# Altium project norbi_lm.PrjPcb (part 2 of 2)

## Sheet norbi_lm_pl_dcr_power_ch.SchDoc: Имя
size 209 x 297 mm; ApprovedBy: Утвердил; CheckedBy: Проверил; Author: Разработал; Organization: НГУ; DocumentNumber: Децимальный номер Э3; SheetNumber: Лист; SheetTotal: Листов; PageSetup: Record=PageOptions|CenterHorizontal=True|CenterVertical=True|PrintScale=1.00|XCorrection=1.00|YCorrection=1.00|PrintKind=1|BorderSize=5000000|LeftOffset=0|BottomOffset=0|Orientation=2|PaperLength=1000|PaperWidth=1000|Scale=100|PaperSource=15|PrintQuality=1200|MediaType=1|DitherType=10|PaperKind=A3|PrintScaleMode=1; Weight: -; ScaleFactor: -; NormInspection: Норм.Контр.
Used 2 times, as channels pl_dcr/mcu_pwr, pl_dcr/measure_pwr. Parts and nets are listed once, with the designators drawn on the sheet.
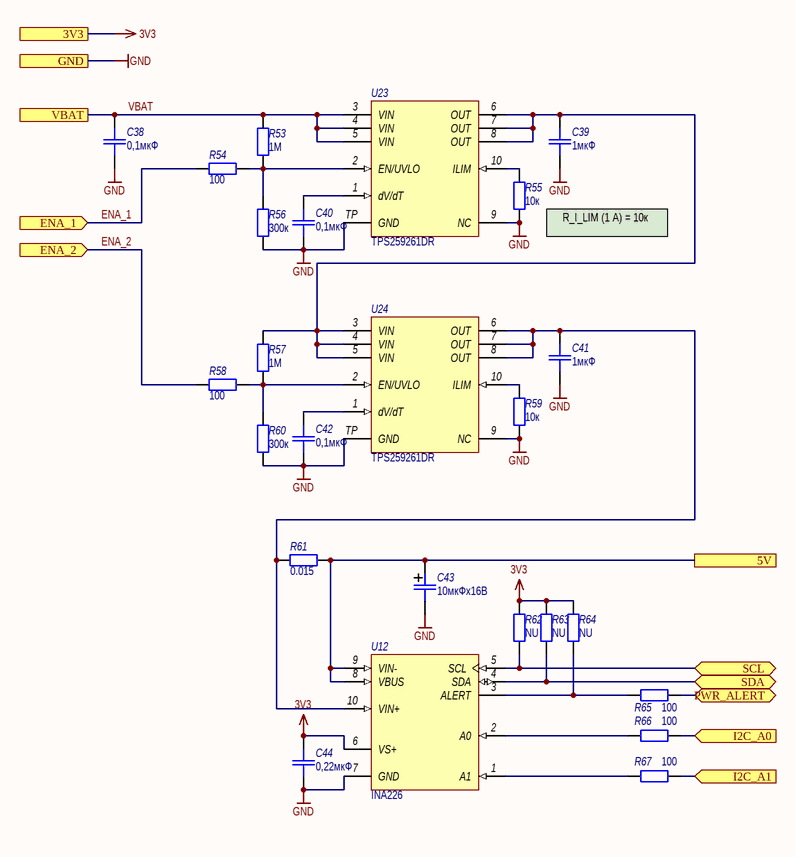
[diagram p5: norbi_lm_pl_dcr_power_ch.SchDoc]

### Parts
C38  0,1мкФ  [CR-0603]
C39  1мкФ  [CR-0603]
C40  0,1мкФ  [CR-0603]
C41  1мкФ  [CR-0603]
C42  0,1мкФ  [CR-0603]
C43  10мкФх16В  [C_SMD_SIZE_B]
C44  0,22мкФ  [CR-0603]
R53  1М  [CR-0603]
R54  100  [CR-0603]
R55  10к  [CR-0603]
R56  300к  [CR-0603]
R57  1М  [CR-0603]
R58  100  [CR-0603]
R59  10к  [CR-0603]
R60  300к  [CR-0603]
R61  0.015  [CR-1206]
R62  NU  [CR-0603]
R63  NU  [CR-0603]
R64  NU  [CR-0603]
R65  100  [CR-0603]
R66  100  [CR-0603]
R67  100  [CR-0603]
U12  INA261  [VSSOP-8]  (value not drawn)
U23  Наименование: TPS259261DR  [VSON-10]  (hidden comment: TPS259261ВК)
U24  Наименование: TPS259261DR  [VSON-10]  (hidden comment: TPS259261ВК)

### Ports
3V3, 5V, ENA_1 (in), ENA_2 (in), GND, I2C_A0 (in), I2C_A1 (in), PWR_ALERT (bidir), SCL (bidir), SDA (bidir), VBAT

### Nets
3V3: C44.2 R62.2 R63.2 R64.2 U12.6(VS+) ; port 3V3
GND: C38.1 C39.1 C40.1 C41.1 C42.1 C43.2 C44.1 R55.1 R56.1 R59.1 R60.1 U12.7(GND) U23.9(NC) U23.TP(GND) U24.9(NC) U24.TP(GND) ; port GND
5V: C43.1 R61.1 U12.8(VBUS) U12.9(VIN-) ; port 5V
ENA_1: R54.2 ; port ENA_1
ENA_2: R58.2 ; port ENA_2
I2C_A0: R66.1 ; port I2C_A0
I2C_A1: R67.1 ; port I2C_A1
PWR_ALERT: R65.1 ; port PWR_ALERT
SCL: R62.1 U12.5(SCL) ; port SCL
SDA: R63.1 U12.4(SDA) ; port SDA
VBAT: C38.2 R53.2 U23.3(VIN) U23.4(VIN) U23.5(VIN) ; port VBAT
NetC39_2: C39.2 R57.2 U23.6(OUT) U23.7(OUT) U23.8(OUT) U24.3(VIN) U24.4(VIN) U24.5(VIN)
NetC40_2: C40.2 U23.1(dV/dT)
NetC41_2: C41.2 R61.2 U12.10(VIN+) U24.6(OUT) U24.7(OUT) U24.8(OUT)
NetC42_2: C42.2 U24.1(dV/dT)
NetR53_1: R53.1 R54.1 R56.2 U23.2(EN/UVLO)
NetR55_2: R55.2 U23.10(ILIM)
NetR57_1: R57.1 R58.1 R60.2 U24.2(EN/UVLO)
NetR59_2: R59.2 U24.10(ILIM)
NetR64_1: R64.1 R65.2 U12.3(ALERT)
NetR66_2: R66.2 U12.2(A0)
NetR67_2: R67.2 U12.1(A1)

### Channels
pl_dcr/mcu_pwr: designators end in _1; ports 3V3=3V3 5V=5V_MCU_PLDCR ENA_1=PWR_ENA1_1_PLDCR ENA_2=PWR_ENA1_2_PLDCR GND=GND I2C_A0=3V3 I2C_A1=3V3 PWR_ALERT=PWR_ALERT SCL=PWR_SCL SDA=PWR_SDA VBAT=VBAT
pl_dcr/measure_pwr: designators end in _2; ports 3V3=3V3 5V=5V_MEAS_PLDCR ENA_1=PWR_ENA2_1_PLDCR ENA_2=PWR_ENA2_2_PLDCR GND=GND I2C_A0=PWR_SDA I2C_A1=3V3 PWR_ALERT=PWR_ALERT SCL=PWR_SCL SDA=PWR_SDA VBAT=VBAT

### Notes on the sheet
- (near R55) R_I_LIM (1 А) = 10к
- Подп. и дата
- Инв. № дубл.
- Взам. инв. №
- Инв. № подл.
- Изм.
- Лист
- № докум.
- Подп.
- Дата
- Форма 2а ГОСТ 2.104-2006
- Копировал
- Формат А4

### Library data of the parts
C38-C42 C44 = C_smd: as C1 on sheet norbi_lm_main; Наименование: SMD-0603
  C38 C40 C42: Value: 0,1мкФ
  C39 C41: Value: 1мкФ
  C44: Value: 0,22мкФ
C43 = C_pol_smd: as C27 on sheet norbi_lm_single_power_ch; Value: 10мкФх16В
R53 R56 R57 R60 R62-R64 = R_smd: as R31 on sheet norbi_lm_single_power_ch
  R53 R57: Value: 1М
  R56 R60: Value: 300к
  R62-R64: Value: NU
R54 R55 R58 R59 R65-R67 = R_smd: as R20 on sheet norbi_lm_pl_interface
  R54 R58 R65-R67: Value: 100
  R55 R59: Value: 10к
R61 = R_smd: Резистор для поверхностного монтажа; Назначение: Чип-резистор токоизмерительный; Наименование: PE1206DRM470R015L; Потребление, Вт: 0,001; Value: 0.015
U12 = INA226: High- or Low-Side Measurement, Bidirectional Current and Power Monitor With I2C Interface; Назначение: High-Side or Low-Side Measurement,; Потребление, Вт: 0,001; ComponentLink1Description: Data sheet; ComponentLink1URL: http://www.ti.com/lit/ds/symlink/ina226.pdf; Наименование: INA226
U23 U24 = TPS259261: Simple 5-V/12-V eFuse Protection Switches; Потребление, Вт: 0,001; Назначение: Simple 5-V/12-V eFuse Protection Switches; ComponentLink1Description: Datasheet; ComponentLink1URL: http://www.ti.com/lit/ds/symlink/tps25925.pdf

## Sheet norbi_lm_interface.SchDoc: Имя
size 209 x 297 mm; ApprovedBy: Утвердил; CheckedBy: Проверил; Author: Разработал; Organization: НГУ; DocumentNumber: Децимальный номер Э3; SheetNumber: Лист; SheetTotal: Листов; PageSetup: Record=PageOptions|CenterHorizontal=True|CenterVertical=True|PrintScale=1.00|XCorrection=1.00|YCorrection=1.00|PrintKind=1|BorderSize=5000000|LeftOffset=0|BottomOffset=0|Orientation=2|PaperLength=1000|PaperWidth=1000|Scale=100|PaperSource=15|PrintQuality=1200|MediaType=1|DitherType=10|PaperKind=A3|PrintScaleMode=1; Weight: -; ScaleFactor: -; NormInspection: Норм.Контр.
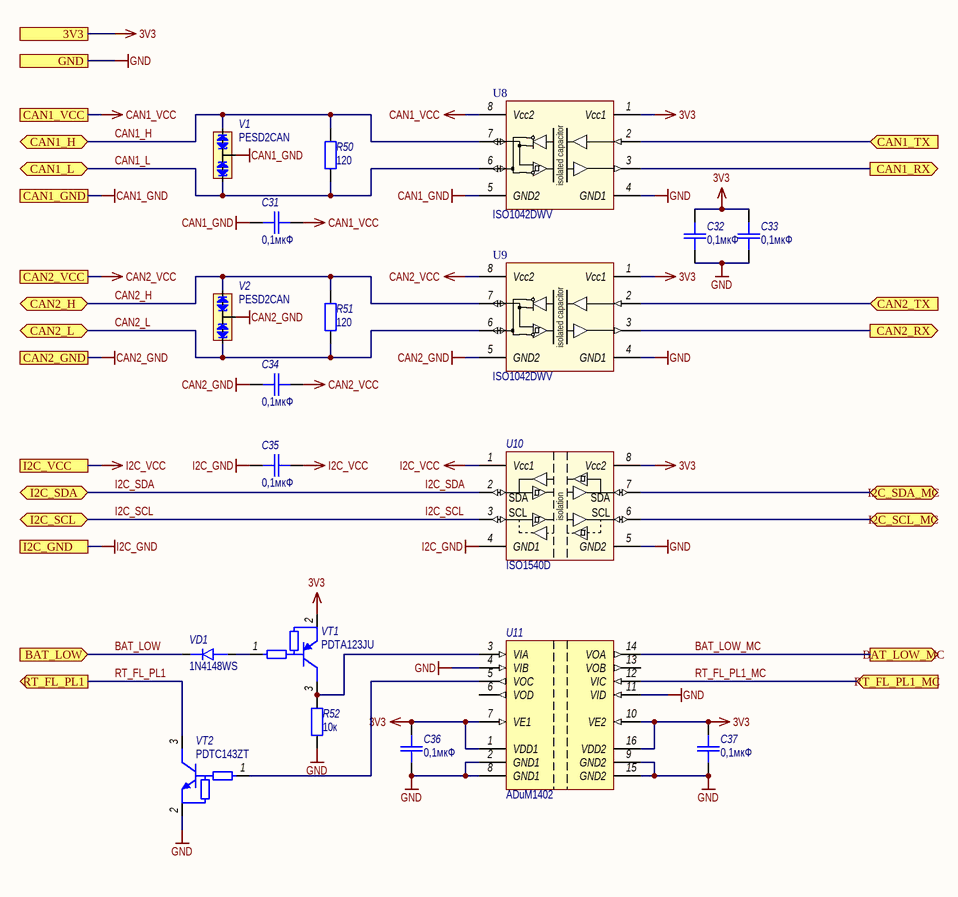
[diagram p6: norbi_lm_interface.SchDoc]

### Parts
C31  0,1мкФ  [CR-0603]
C32  0,1мкФ  [CR-0603]
C33  0,1мкФ  [CR-0603]
C34  0,1мкФ  [CR-0603]
C35  0,1мкФ  [CR-0603]
C36  0,1мкФ  [CR-0603]
C37  0,1мкФ  [CR-0603]
R50  120  [CR-0603]
R51  120  [CR-0603]
R52  10к  [CR-0603]
U8  Наименование: ISO1042DWV  [SOIC-8-WIDE]  (hidden comment: ISO1042)
U9  Наименование: ISO1042DWV  [SOIC-8-WIDE]  (hidden comment: ISO1042)
U10  Наименование: ISO1540D  [SOIC-8]  (hidden comment: ISO1540)
U11  ADuM1402  [SOIC-16-WIDE]
V1  PESD2CAN  [SOT-23]
V2  PESD2CAN  [SOT-23]
VD1  1N4148WS  [SOD-323]
VT1  PDTA123JU  [SOT-323 (SC-70)]
VT2  PDTC143ZT  [SOT-23]

### Ports
3V3, BAT_LOW (in), BAT_LOW_MC (out), CAN1_GND, CAN1_H (bidir), CAN1_L (bidir), CAN1_RX (out), CAN1_TX (in), CAN1_VCC, CAN2_GND, CAN2_H (bidir), CAN2_L (bidir), CAN2_RX (out), CAN2_TX (in), CAN2_VCC, GND, I2C_GND, I2C_SCL (bidir), I2C_SCL_MC (bidir), I2C_SDA (bidir), I2C_SDA_MC (bidir), I2C_VCC, RT_FL_PL1 (out), RT_FL_PL1_MC (in)

### Nets
3V3: C32.2 C33.2 C36.2 C37.2 U8.1(Vcc1) U9.1(Vcc1) U10.8(Vcc2) U11.1(VDD1) U11.7(VE1) U11.10(VE2) U11.16(VDD2) VT1.2(E) ; port 3V3
CAN1_GND: C31.1 U8.5(GND2) V1.3(CC) ; port CAN1_GND
CAN1_VCC: C31.2 U8.8(Vcc2) ; port CAN1_VCC
CAN2_GND: C34.1 U9.5(GND2) V2.3(CC) ; port CAN2_GND
CAN2_VCC: C34.2 U9.8(Vcc2) ; port CAN2_VCC
GND: C32.1 C33.1 C36.1 C37.1 R52.2 U8.4(GND1) U9.4(GND1) U10.5(GND2) U11.2(GND1) U11.4(VIB) U11.8(GND1) U11.9(GND2) U11.11(VID) U11.15(GND2) VT2.2(E) ; port GND
I2C_GND: C35.1 U10.4(GND1) ; port I2C_GND
I2C_VCC: C35.2 U10.1(Vcc1) ; port I2C_VCC
BAT_LOW: VD1.1(Cathode) ; port BAT_LOW
BAT_LOW_MC: U11.14(VOA) ; port BAT_LOW_MC
CAN1_H: R50.2 U8.7(CANH) V1.1(C1) ; port CAN1_H
CAN1_L: R50.1 U8.6(CANL) V1.2(C2) ; port CAN1_L
CAN1_RX: U8.3(RXD) ; port CAN1_RX
CAN1_TX: U8.2(TXD) ; port CAN1_TX
CAN2_H: R51.2 U9.7(CANH) V2.1(C1) ; port CAN2_H
CAN2_L: R51.1 U9.6(CANL) V2.2(C2) ; port CAN2_L
CAN2_RX: U9.3(RXD) ; port CAN2_RX
CAN2_TX: U9.2(TXD) ; port CAN2_TX
I2C_SCL: U10.3(SCL) ; port I2C_SCL
I2C_SCL_MC: U10.6(SCL) ; port I2C_SCL_MC
I2C_SDA: U10.2(SDA) ; port I2C_SDA
I2C_SDA_MC: U10.7(SDA) ; port I2C_SDA_MC
RT_FL_PL1: VT2.3(C) ; port RT_FL_PL1
RT_FL_PL1_MC: U11.12(VIC) ; port RT_FL_PL1_MC
NetR52_1: R52.1 U11.3(VIA) VT1.3(C)
NetU11_5: U11.5(VOC) VT2.1(B)
NetVD1_2: VD1.2(Anode) VT1.1(B)

Not connected (* = marked no-connect by the designer): U11 6(VOD) 13(VOB)

### Notes on the sheet
- Подп. и дата
- Инв. № дубл.
- Взам. инв. №
- Инв. № подл.
- Изм.
- Лист
- № докум.
- Подп.
- Дата
- Форма 2а ГОСТ 2.104-2006
- Копировал
- Формат А4
- (in symbol ISO154x) isolation
- (in symbol ISO1042) isolated capacitor

### Library data of the parts
C31-C37 = C_smd: Конденсатор для поверхностного монтажа; Назначение: Чип-конденсатор; Потребление, Вт: 0; Наименование: SMD-0603; Value: 0,1мкФ
R50 R51 = R_smd: Резистор для поверхностного монтажа; Наименование: SMD-0603 1%; Назначение: Чип-резистор; Потребление, Вт: 0,001; Value: 120
R52 = R_smd: Резистор для поверхностного монтажа; Наименование: SMD-0603 20%; Назначение: Чип-резистор; Потребление, Вт: 0,001; Value: 10к
U8 U9 = ISO1042: Isolated CAN Transceiver; Назначение: Изолированный CAN приемник; Потребление, Вт: 0,001
U10 = ISO154x: Low-Power Bidirectional I2C Isolators; Потребление, Вт: 0,001; Назначение: Low-Power Bidirectional I2C Isolators
U11 = ADuM1402: Quad Channel Digital Isolator, 2.5 KV rms Insulation Rating; Назначение: 4-канальный цифровой изолятор; Потребление, Вт: 0,025; Наименование: ADuM1402
V1 V2 = PESD2CAN: CAN bus ESD protection diode; Назначение: Защитная диодная сборка CAN-шины от ЭСР; Потребление, Вт: 0,001; Наименование: PESD2CAN
VD1 = BAT60A: Diod 150 mA 100V; Назначение: Диод 150мА 100В; Потребление, Вт: 0,001; Наименование: 1N4148WS
VT1 = PDTA123JU: Digital Transistor (resistor-equipped transistors), R1=R2=2k, PNP Transistor, 3-Pin SC-70; Назначение: Resistor-equipped transistors, R1=R2=2k, PNP Transistor, 3-Pin SC-70; Потребление, Вт: 0,001; ComponentLink1Description: Datasheet; ComponentLink1URL: https://assets.nexperia.com/documents/data-sheet/PDTC114E_SER.pdf; Наименование: PDTA123JU
VT2 = PDTC143ZT: Digital Transistor (BRT), R1=4.7 kOhm, R2=47 kOhm, NPN Transistor, 3-Pin; Потребление, Вт: 0,001; Назначение: Digital Transistor (BRT), R1=4.7 kOhm, R2=47 kOhm, NPN Transistor, 3-Pin; ComponentLink1Description: Datasheet; ComponentLink1URL: https://assets.nexperia.com/documents/data-sheet/PDTC114E_SER.pdf; Наименование: PDTC143ZT

## Sheet norbi_lm_trm.SchDoc: Имя
size 209 x 297 mm; ApprovedBy: Утвердил; CheckedBy: Проверил; Author: Разработал; Organization: НГУ; DocumentNumber: Децимальный номер Э3; SheetNumber: Лист; SheetTotal: Листов; PageSetup: Record=PageOptions|CenterHorizontal=True|CenterVertical=True|PrintScale=1.00|XCorrection=1.00|YCorrection=1.00|PrintKind=1|BorderSize=5000000|LeftOffset=0|BottomOffset=0|Orientation=2|PaperLength=1000|PaperWidth=1000|Scale=100|PaperSource=15|PrintQuality=1200|MediaType=1|DitherType=10|PaperKind=A3|PrintScaleMode=1; Weight: -; ScaleFactor: -; NormInspection: Норм.Контр.
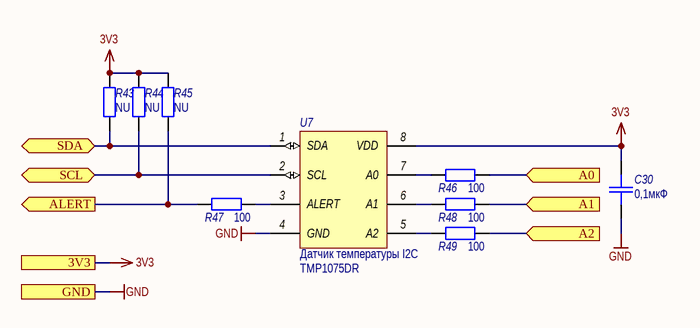
[diagram p7: norbi_lm_trm.SchDoc]

### Parts
C30  0,1мкФ  [CR-0603]
R43  NU  [CR-0603]
R44  NU  [CR-0603]
R45  NU  [CR-0603]
R46  100  [CR-0603]
R47  100  [CR-0603]
R48  100  [CR-0603]
R49  100  [CR-0603]
U7  Назначение: Датчик температуры I2C  Наименование: TMP1075DR  [SOIC-8]  (hidden comment: TMP1075)

### Ports
3V3, A0 (in), A1 (in), A2 (in), ALERT (out), GND, SCL (bidir), SDA (bidir)

### Nets
3V3: C30.2 R43.2 R44.2 R45.2 R46.1 R48.1 R49.1 U7.8(VDD) ; port 3V3, port A0, port A1, port A2
GND: C30.1 U7.4(GND) ; port GND
TRM_ALERT: R45.1 R47.2 ; port ALERT
TRM_SCL: R44.1 U7.2(SCL) ; port SCL
TRM_SDA: R43.1 U7.1(SDA) ; port SDA
NetR46_2: R46.2 U7.7(A0)
NetR47_1: R47.1 U7.3(ALERT)
NetR48_2: R48.2 U7.6(A1)
NetR49_2: R49.2 U7.5(A2)

### Notes on the sheet
- Подп. и дата
- Инв. № дубл.
- Взам. инв. №
- Инв. № подл.
- Изм.
- Лист
- № докум.
- Подп.
- Дата
- Форма 2а ГОСТ 2.104-2006
- Копировал
- Формат А4

### Library data of the parts
C30 = C_smd: as C31-C37 on sheet norbi_lm_interface; Наименование: SMD-0603; Value: 0,1мкФ
R43-R45 = R_smd: Резистор для поверхностного монтажа; Назначение: Чип-резистор; Наименование: SMD-0603 20%; Потребление, Вт: 0,001; Value: NU
R46-R49 = R_smd: as R52 on sheet norbi_lm_interface; Value: 100
U7 = TMP1075: TMP1075 Temperature Sensor With I2C and SMBus Interface; Потребление, Вт: 0,001; ComponentLink1Description: Datasheet; ComponentLink1URL: http://www.ti.com/lit/ds/symlink/tmp1075.pdf

## Sheet norbi_lm_mem.SchDoc: Имя
size 209 x 297 mm; ApprovedBy: Утвердил; CheckedBy: Проверил; Author: Разработал; Organization: НГУ; DocumentNumber: Децимальный номер Э3; SheetNumber: Лист; SheetTotal: Листов; PageSetup: Record=PageOptions|CenterHorizontal=True|CenterVertical=True|PrintScale=1.00|XCorrection=1.00|YCorrection=1.00|PrintKind=1|BorderSize=5000000|LeftOffset=0|BottomOffset=0|Orientation=2|PaperLength=1000|PaperWidth=1000|Scale=100|PaperSource=15|PrintQuality=1200|MediaType=1|DitherType=10|PaperKind=A3|PrintScaleMode=1; Weight: -; ScaleFactor: -; NormInspection: Норм.Контр.
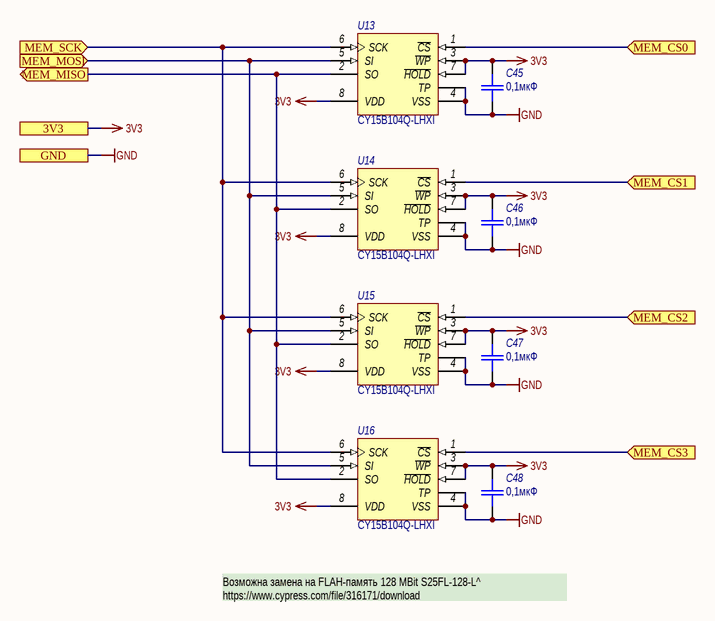
[diagram p8: norbi_lm_mem.SchDoc]

### Parts
C45  0,1мкФ  [CR-0603]
C46  0,1мкФ  [CR-0603]
C47  0,1мкФ  [CR-0603]
C48  0,1мкФ  [CR-0603]
U13  Наименование: CY15B104Q-LHXI  [TDFN-8]  (hidden comment: FM25V20)
U14  Наименование: CY15B104Q-LHXI  [TDFN-8]  (hidden comment: FM25V20)
U15  Наименование: CY15B104Q-LHXI  [TDFN-8]  (hidden comment: FM25V20)
U16  Наименование: CY15B104Q-LHXI  [TDFN-8]  (hidden comment: FM25V20)

### Ports
3V3, GND, MEM_CS0 (in), MEM_CS1 (in), MEM_CS2 (in), MEM_CS3 (in), MEM_MISO (out), MEM_MOSI (in), MEM_SCK (in)

### Nets
3V3: C45.2 C46.2 C47.2 C48.2 U13.3(~{WP}) U13.7(~{HOLD}) U13.8(VDD) U14.3(~{WP}) U14.7(~{HOLD}) U14.8(VDD) U15.3(~{WP}) U15.7(~{HOLD}) U15.8(VDD) U16.3(~{WP}) U16.7(~{HOLD}) U16.8(VDD) ; port 3V3
GND: C45.1 C46.1 C47.1 C48.1 U13.4(VSS) U13.TP U14.4(VSS) U14.TP U15.4(VSS) U15.TP U16.4(VSS) U16.TP ; port GND
MEM_CS0: U13.1(~{CS}) ; port MEM_CS0
MEM_CS1: U14.1(~{CS}) ; port MEM_CS1
MEM_CS2: U15.1(~{CS}) ; port MEM_CS2
MEM_CS3: U16.1(~{CS}) ; port MEM_CS3
MEM_MISO: U13.2(SO) U14.2(SO) U15.2(SO) U16.2(SO) ; port MEM_MISO
MEM_MOSI: U13.5(SI) U14.5(SI) U15.5(SI) U16.5(SI) ; port MEM_MOSI
MEM_SCK: U13.6(SCK) U14.6(SCK) U15.6(SCK) U16.6(SCK) ; port MEM_SCK

### Notes on the sheet
- Возможна замена на FLAH-память 128 MBit S25FL-128-L^
  https://www.cypress.com/file/316171/download
- Подп. и дата
- Инв. № дубл.
- Взам. инв. №
- Инв. № подл.
- Изм.
- Лист
- № докум.
- Подп.
- Дата
- Форма 2а ГОСТ 2.104-2006
- Копировал
- Формат А4

### Library data of the parts
C45-C48 = C_smd: as C31-C37 on sheet norbi_lm_interface; Наименование: SMD-0603; Value: 0,1мкФ
U13-U16 = FM25V: 2Mb Serial 3V FRAM Memory; Назначение: 4Mb Serial 3V FRAM Memory; Потребление, Вт: 0,009; ComponentLink1Description: Datasheet
  U13: ComponentLink1URL: https://www.cypress.com/file/209146/download
  U14-U16: ComponentLink1URL: https://www.cypress.com/file/136456/download

## Sheet norbi_lm_usb.SchDoc: Имя
size 209 x 297 mm; ApprovedBy: Утвердил; CheckedBy: Проверил; Author: Разработал; Organization: НГУ; DocumentNumber: Децимальный номер Э3; SheetNumber: Лист; SheetTotal: Листов; PageSetup: Record=PageOptions|CenterHorizontal=True|CenterVertical=True|PrintScale=1.00|XCorrection=1.00|YCorrection=1.00|PrintKind=1|BorderSize=5000000|LeftOffset=0|BottomOffset=0|Orientation=2|PaperLength=1000|PaperWidth=1000|Scale=100|PaperSource=15|PrintQuality=1200|MediaType=1|DitherType=10|PaperKind=A3|PrintScaleMode=1; Weight: -; ScaleFactor: -; NormInspection: Норм.Контр.
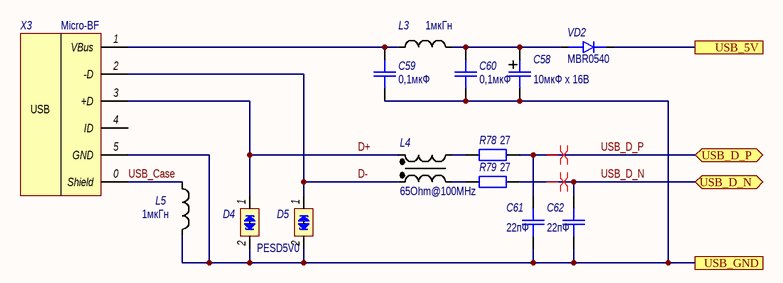
[diagram p9: norbi_lm_usb.SchDoc]

### Parts
C58  10мкФ х 16В  [C_SMD_SIZE_B]
C59  0,1мкФ  [CR-0603]
C60  0,1мкФ  [CR-0603]
C61  22пФ  [CR-0603]
C62  22пФ  [CR-0603]
D4  PESD5V0  [SOD-323]
D5  PESD5V0  [SOD-323]  (value not drawn)
L3  1мкГн  [CR-0805]
L4  65Ohm@100MHz  [ACM2012]
L5  1мкГн  [CR-0805]
R78  27  [CR-0603]
R79  27  [CR-0603]
VD2  MBR0540  [SOD-323]
X3  Наименование: Micro-BF  [USB Micro-BF]  (hidden comment: mico-BF)

### Ports
USB_5V, USB_D_N (bidir), USB_D_P (bidir), USB_GND

### Nets
GND: C58.2 C59.1 C60.1 C61.1 C62.1 D4.2(cathode_2) D5.2(cathode_2) L5.2 X3.5(GND) ; port USB_GND
D+: D4.1(cathode_1) L4.2 X3.3(+D)
D-: D5.1(cathode_1) L4.1 X3.2(-D)
USB_Case: L5.1 X3.0(Shield)
USB_D_N: C62.2 R79.1 ; port USB_D_N
USB_D_P: C61.2 R78.1 ; port USB_D_P
NetC58_1: C58.1 C60.2 L3.2 VD2.2(Anode)
NetC59_2: C59.2 L3.1 X3.1(VBus)
NetL4_3: L4.3 R78.2
NetL4_4: L4.4 R79.2
NetR1_1: VD2.1(Cathode) ; port USB_5V

Not connected (* = marked no-connect by the designer): X3 4(ID)

### Layout directives
differential pair: USB_D_N, USB_D_P

### Notes on the sheet
- Подп. и дата
- Инв. № дубл.
- Взам. инв. №
- Инв. № подл.
- Изм.
- Лист
- № докум.
- Подп.
- Дата
- Форма 2а ГОСТ 2.104-2006
- Копировал
- Формат А4
- (in symbol MicroUSB) USB

### Library data of the parts
C58 = C_pol_smd: Поляризованный конеднсатор для поверхностного монтажа; Назначение: Поляризованный чип-конденсатор; Наименование: Конденсатор танталовый SMD; Потребление, Вт: 0; Value: 10мкФ х 16В
C59-C62 = C_smd: as C31-C37 on sheet norbi_lm_interface; Наименование: SMD-0603
  C59 C60: Value: 0,1мкФ
  C61 C62: Value: 22пФ
D4 D5 = PESD5V0S: Low capacitance bidirectional ESD protection diodes; Назначение: ESD защитные диоды; Потребление, Вт: 0,000; Наименование: PESD5V0S1BA
L3 L5 = L_smd: Индуктивность для поверхностнгого монтажа; Назначение: Чип-индуктивность; Потребление, Вт: 0,010; Value: 1мкГн; Наименование: Индуктивность
L4 = ACM2012_USB_CM_FILTER: USB common mode filter; Назначение: Связанная индуктивность; Наименование: ACM2012-900-2P; Потребление, Вт: 0,001; Value: 65Ohm@100MHz
R78 R79 = R_smd: as R52 on sheet norbi_lm_interface; Value: 27
VD2 = BAT60A: Schottky diode; Назначение: Диод шотки; Потребление, Вт: 0,001; Наименование: MBR0540
X3 = MicroUSB: USB mico-BF; Назначение: Micro-USB разъем на плату

## Nets that join several sheets
3V3: norbi_lm_main (44 pins), norbi_lm_pl_iss (H1.14), pl_iss/pl_interface_1 (11 pins), pl_iss/pl_interface_2 (11 pins), pl_iss/pl_interface_3 (11 pins), pl_iss/pl_interface_4 (11 pins), pl_iss/pl_pwr_ch_1 (7 pins), pl_iss/pl_pwr_ch_2 (6 pins), pl_iss/pl_pwr_ch_3 (6 pins), pl_iss/pl_pwr_ch_4 (7 pins), norbi_lm_pl_dcr (6 pins), pl_dcr/mcu_pwr (7 pins), pl_dcr/measure_pwr (6 pins), norbi_lm_interface (12 pins), norbi_lm_trm (8 pins), norbi_lm_mem (16 pins), lm_pwr_ch (9 pins)
5V_PL1.1B: norbi_lm_pl_iss (H2.5 H2.7), pl_iss/pl_interface_2 (15 pins), pl_iss/pl_pwr_ch_2 (R30_2.1 U6_2.8 U6_2.9)
5V_PL1.1А: norbi_lm_pl_iss (H1.5 H1.7), pl_iss/pl_interface_1 (15 pins), pl_iss/pl_pwr_ch_1 (R30_1.1 U6_1.8 U6_1.9)
5V_PL1.2: norbi_lm_pl_iss (H2.27 H2.29), pl_iss/pl_interface_3 (15 pins), pl_iss/pl_pwr_ch_3 (R30_3.1 U6_3.8 U6_3.9)
5V_PL2: norbi_lm_pl_iss (6 pins), pl_iss/pl_interface_4 (15 pins), pl_iss/pl_pwr_ch_4 (R30_4.1 U6_4.8 U6_4.9)
CAN1_GND: norbi_lm_main (H3.5 H3.6), norbi_lm_interface (C31.1 U8.5 V1.3)
CAN1_VCC: norbi_lm_main (H3.7 H3.8), norbi_lm_interface (C31.2 U8.8)
CAN2_GND: norbi_lm_main (H3.13 H3.14), norbi_lm_interface (C34.1 U9.5 V2.3)
CAN2_VCC: norbi_lm_main (H3.15 H3.16), norbi_lm_interface (C34.2 U9.8)
GND: norbi_lm_main (40 pins), norbi_lm_pl_iss (24 pins), pl_iss/pl_interface_1 (27 pins), pl_iss/pl_interface_2 (27 pins), pl_iss/pl_interface_3 (27 pins), pl_iss/pl_interface_4 (27 pins), pl_iss/pl_pwr_ch_1 (22 pins), pl_iss/pl_pwr_ch_2 (22 pins), pl_iss/pl_pwr_ch_3 (22 pins), pl_iss/pl_pwr_ch_4 (22 pins), norbi_lm_pl_dcr (11 pins), pl_dcr/mcu_pwr (16 pins), pl_dcr/measure_pwr (16 pins), norbi_lm_interface (15 pins), norbi_lm_trm (C30.1 U7.4), norbi_lm_mem (12 pins), lm_pwr_ch (25 pins), norbi_lm_usb (9 pins)
I2C_GND: norbi_lm_main (H3.25 H3.26), norbi_lm_interface (C35.1 U10.4)
I2C_VCC: norbi_lm_main (H3.27 H3.28), norbi_lm_interface (C35.2 U10.1)
VBAT: norbi_lm_main (R1.2 R2.2 R3.2), pl_iss/pl_pwr_ch_1 (10 pins), pl_iss/pl_pwr_ch_2 (10 pins), pl_iss/pl_pwr_ch_3 (10 pins), pl_iss/pl_pwr_ch_4 (10 pins), pl_dcr/mcu_pwr (5 pins), pl_dcr/measure_pwr (5 pins), lm_pwr_ch (10 pins)
5V_MCU_PLDCR: norbi_lm_pl_dcr (X2.3), pl_dcr/mcu_pwr (C43_1.1 R61_1.1 U12_1.8 U12_1.9)
5V_MEAS_PLDCR: norbi_lm_pl_dcr (X2.4), pl_dcr/measure_pwr (C43_2.1 R61_2.1 U12_2.8 U12_2.9)
A_CPU_ERROR: norbi_lm_main (U1.2), pl_iss/pl_interface_1 (U20_1.11)
A_CPU_ERROR_PL: norbi_lm_pl_iss (H1.20), pl_iss/pl_interface_1 (R73_1.1)
A_INT: norbi_lm_main (U1.141), pl_iss/pl_interface_1 (U20_1.14)
A_INT_PL: norbi_lm_pl_iss (H1.17), pl_iss/pl_interface_1 (U20_1.3)
A_PWR_ERROR: norbi_lm_main (U1.142), pl_iss/pl_interface_1 (U20_1.13)
A_PWR_ERROR_PL: norbi_lm_pl_iss (H1.19), pl_iss/pl_interface_1 (U20_1.4)
A_RSTFPGA: norbi_lm_main (U1.56), pl_iss/pl_interface_1 (U19_1.3)
A_RSTFPGA_PL: norbi_lm_pl_iss (H1.11), pl_iss/pl_interface_1 (U19_1.14)
A_RSTLEON: norbi_lm_main (U1.57), pl_iss/pl_interface_1 (U19_1.4)
A_RSTLEON_PL: norbi_lm_pl_iss (H1.12), pl_iss/pl_interface_1 (U19_1.13)
A_WATCHDOG: norbi_lm_main (U1.1), pl_iss/pl_interface_1 (U20_1.12)
A_WATCHDOG_PL: norbi_lm_pl_iss (H1.18), pl_iss/pl_interface_1 (U20_1.5)
B_CPU_ERROR: norbi_lm_main (U1.58), pl_iss/pl_interface_2 (U20_2.11)
B_CPU_ERROR_PL: norbi_lm_pl_iss (H2.20), pl_iss/pl_interface_2 (R73_2.1)
B_INT: norbi_lm_main (U1.3), pl_iss/pl_interface_2 (U20_2.14)
B_INT_PL: norbi_lm_pl_iss (H2.17), pl_iss/pl_interface_2 (U20_2.3)
B_PWR_ERROR: norbi_lm_main (U1.4), pl_iss/pl_interface_2 (U20_2.13)
B_PWR_ERROR_PL: norbi_lm_pl_iss (H2.19), pl_iss/pl_interface_2 (U20_2.4)
B_RSTFPGA: norbi_lm_main (U1.89), pl_iss/pl_interface_2 (U19_2.3)
B_RSTFPGA_PL: norbi_lm_pl_iss (H2.11), pl_iss/pl_interface_2 (U19_2.14)
B_RSTLEON: norbi_lm_main (U1.90), pl_iss/pl_interface_2 (U19_2.4)
B_RSTLEON_PL: norbi_lm_pl_iss (H2.12), pl_iss/pl_interface_2 (U19_2.13)
B_WATCHDOG: norbi_lm_main (U1.5), pl_iss/pl_interface_2 (U20_2.12)
B_WATCHDOG_PL: norbi_lm_pl_iss (H2.18), pl_iss/pl_interface_2 (U20_2.5)
BAT_LOW: norbi_lm_main (H3.17 H3.18), norbi_lm_interface (VD1.1)
BAT_LOW_MC: norbi_lm_main (U1.27), norbi_lm_interface (U11.14)
C_TK_nRESET: norbi_lm_main (U1.93), pl_iss/pl_interface_3 (U19_3.3)
C_TK_nRESET_PL: norbi_lm_pl_iss (H2.31), pl_iss/pl_interface_3 (U19_3.14)
C_TK_SPI_SEL: norbi_lm_main (U1.124), pl_iss/pl_interface_3 (U19_3.4)
C_TK_SPI_SEL_PL: norbi_lm_pl_iss (H2.33), pl_iss/pl_interface_3 (U19_3.13)
C_TM_CPU_OK: norbi_lm_main (U1.63), pl_iss/pl_interface_3 (U20_3.12)
C_TM_CPU_OK_PL: norbi_lm_pl_iss (H2.37), pl_iss/pl_interface_3 (U20_3.5)
C_TM_ERR: norbi_lm_main (U1.64), pl_iss/pl_interface_3 (U20_3.11)
C_TM_ERR_PL: norbi_lm_pl_iss (H2.38), pl_iss/pl_interface_3 (R73_3.1)
C_TM_INT: norbi_lm_main (U1.60), pl_iss/pl_interface_3 (U20_3.13)
C_TM_INT_PL: norbi_lm_pl_iss (H2.36), pl_iss/pl_interface_3 (U20_3.4)
C_TM_PWR_ERR: norbi_lm_main (U1.59), pl_iss/pl_interface_3 (U20_3.14)
C_TM_PWR_ERR_PL: norbi_lm_pl_iss (H2.35), pl_iss/pl_interface_3 (U20_3.3)
CAN1_H: norbi_lm_main (H3.3 H3.4), norbi_lm_interface (R50.2 U8.7 V1.1)
CAN1_L: norbi_lm_main (H3.1 H3.2), norbi_lm_interface (R50.1 U8.6 V1.2)
CAN1_RX: norbi_lm_main (U1.114), norbi_lm_interface (U8.3)
CAN1_TX: norbi_lm_main (U1.115), norbi_lm_interface (U8.2)
CAN2_H: norbi_lm_main (H3.11 H3.12), norbi_lm_interface (R51.2 U9.7 V2.1)
CAN2_L: norbi_lm_main (H3.9 H3.10), norbi_lm_interface (R51.1 U9.6 V2.2)
CAN2_RX: norbi_lm_main (U1.135), norbi_lm_interface (U9.3)
CAN2_TX: norbi_lm_main (U1.136), norbi_lm_interface (U9.2)
CANH RX_1.1A: norbi_lm_pl_iss (H1.6), pl_iss/pl_interface_1 (R72_1.2 U18_1.7 V4_1.1)
CANH RX_1.1B: norbi_lm_pl_iss (H2.6), pl_iss/pl_interface_2 (R72_2.2 U18_2.7 V4_2.1)
CANH RX_PL1.2: norbi_lm_pl_iss (H2.32), pl_iss/pl_interface_3 (R72_3.2 U18_3.7 V4_3.1)
CANH RX_PL2: norbi_lm_pl_iss (H1.48), pl_iss/pl_interface_4 (R72_4.2 U18_4.7 V4_4.1)
CANH TX_1.1A: norbi_lm_pl_iss (H1.2), pl_iss/pl_interface_1 (R68_1.2 U17_1.7 V3_1.1)
CANH TX_1.1B: norbi_lm_pl_iss (H2.2), pl_iss/pl_interface_2 (R68_2.2 U17_2.7 V3_2.1)
CANH TX_PL1.2: norbi_lm_pl_iss (H2.28), pl_iss/pl_interface_3 (R68_3.2 U17_3.7 V3_3.1)
CANH TX_PL2: norbi_lm_pl_iss (H1.44), pl_iss/pl_interface_4 (R68_4.2 U17_4.7 V3_4.1)
CANL RX_1.1A: norbi_lm_pl_iss (H1.8), pl_iss/pl_interface_1 (R72_1.1 U18_1.6 V4_1.2)
CANL RX_1.1B: norbi_lm_pl_iss (H2.8), pl_iss/pl_interface_2 (R72_2.1 U18_2.6 V4_2.2)
CANL RX_PL1.2: norbi_lm_pl_iss (H2.34), pl_iss/pl_interface_3 (R72_3.1 U18_3.6 V4_3.2)
CANL RX_PL2: norbi_lm_pl_iss (H1.50), pl_iss/pl_interface_4 (R72_4.1 U18_4.6 V4_4.2)
CANL TX_1.1A: norbi_lm_pl_iss (H1.4), pl_iss/pl_interface_1 (R68_1.1 U17_1.6 V3_1.2)
CANL TX_1.1B: norbi_lm_pl_iss (H2.4), pl_iss/pl_interface_2 (R68_2.1 U17_2.6 V3_2.2)
CANL TX_PL1.2: norbi_lm_pl_iss (H2.30), pl_iss/pl_interface_3 (R68_3.1 U17_3.6 V3_3.2)
CANL TX_PL2: norbi_lm_pl_iss (H1.46), pl_iss/pl_interface_4 (R68_4.1 U17_4.6 V3_4.2)
CURRENT_MON: norbi_lm_main (U1.66), pl_iss/pl_interface_4 (U20_4.13)
CURRENT_MON_PL: norbi_lm_pl_iss (H2.51), pl_iss/pl_interface_4 (U20_4.4)
EXT_RESET: norbi_lm_main (U1.127), pl_iss/pl_interface_4 (U19_4.3)
EXT_RESET_PL: norbi_lm_pl_iss (H2.45), pl_iss/pl_interface_4 (U19_4.14)
I2C_SCL: norbi_lm_main (H3.23 H3.24), norbi_lm_interface (U10.3)
I2C_SCL_MC: norbi_lm_main (R6.2 U1.139), norbi_lm_interface (U10.6)
I2C_SDA: norbi_lm_main (H3.21 H3.22), norbi_lm_interface (U10.2)
I2C_SDA_MC: norbi_lm_main (R5.2 U1.137), norbi_lm_interface (U10.7)
INTERRUPT: norbi_lm_main (U1.67), pl_iss/pl_interface_4 (U20_4.12)
INTERRUPT_PL: norbi_lm_pl_iss (H2.49), pl_iss/pl_interface_4 (U20_4.5)
KU_1_PL2: norbi_lm_main (U1.128), pl_iss/pl_interface_4 (U19_4.4)
KU_2_PL1.1A: norbi_lm_main (U1.87), pl_iss/pl_interface_1 (U19_1.5)
KU_2_PL1.1B: norbi_lm_main (U1.91), pl_iss/pl_interface_2 (U19_2.5)
KU_2_PL1.2: norbi_lm_main (U1.125), pl_iss/pl_interface_3 (U19_3.5)
KU_2_PL2: norbi_lm_main (U1.129), pl_iss/pl_interface_4 (U19_4.5)
KU_3_PL1.1A: norbi_lm_main (U1.88), pl_iss/pl_interface_1 (U19_1.6)
KU_3_PL1.1B: norbi_lm_main (U1.92), pl_iss/pl_interface_2 (U19_2.6)
KU_3_PL1.2: norbi_lm_main (U1.126), pl_iss/pl_interface_3 (U19_3.6)
KU_3_PL2: norbi_lm_main (U1.132), pl_iss/pl_interface_4 (U19_4.6)
MEM_CS0: norbi_lm_main (U1.79), norbi_lm_mem (U13.1)
MEM_CS1: norbi_lm_main (U1.80), norbi_lm_mem (U14.1)
MEM_CS2: norbi_lm_main (U1.81), norbi_lm_mem (U15.1)
MEM_CS3: norbi_lm_main (U1.82), norbi_lm_mem (U16.1)
MEM_MISO: norbi_lm_main (U1.75), norbi_lm_mem (U13.2 U14.2 U15.2 U16.2)
MEM_MOSI: norbi_lm_main (U1.76), norbi_lm_mem (U13.5 U14.5 U15.5 U16.5)
MEM_SCK: norbi_lm_main (U1.74), norbi_lm_mem (U13.6 U14.6 U15.6 U16.6)
NetR1_1: norbi_lm_main (R1.1), norbi_lm_usb (VD2.1)
PWR_ALERT: norbi_lm_main (R11.2 U1.111), pl_iss/pl_pwr_ch_1 (R38_1.1), pl_iss/pl_pwr_ch_2 (R38_2.1), pl_iss/pl_pwr_ch_3 (R38_3.1), pl_iss/pl_pwr_ch_4 (R38_4.1), pl_dcr/mcu_pwr (R65_1.1), pl_dcr/measure_pwr (R65_2.1), lm_pwr_ch (R38_5.1)
PWR_ENA1_1_PLDCR: norbi_lm_main (U1.50), pl_dcr/mcu_pwr (R54_1.2)
PWR_ENA1_2_PLDCR: norbi_lm_main (U1.53), pl_dcr/mcu_pwr (R58_1.2)
PWR_ENA2_1_PLDCR: norbi_lm_main (U1.54), pl_dcr/measure_pwr (R54_2.2)
PWR_ENA2_2_PLDCR: norbi_lm_main (U1.55), pl_dcr/measure_pwr (R58_2.2)
PWR_ENA_1_PL1.1A: norbi_lm_main (U1.10), pl_iss/pl_pwr_ch_1 (R24_1.2)
PWR_ENA_1_PL1.1B: norbi_lm_main (U1.13), pl_iss/pl_pwr_ch_2 (R24_2.2)
PWR_ENA_1_PL1.2: norbi_lm_main (U1.18), pl_iss/pl_pwr_ch_3 (R24_3.2)
PWR_ENA_1_PL2: norbi_lm_main (U1.21), pl_iss/pl_pwr_ch_4 (R24_4.2)
PWR_ENA_2_PL1.1A: norbi_lm_main (U1.11), pl_iss/pl_pwr_ch_1 (R25_1.2)
PWR_ENA_2_PL1.1B: norbi_lm_main (U1.14), pl_iss/pl_pwr_ch_2 (R25_2.2)
PWR_ENA_2_PL1.2: norbi_lm_main (U1.19), pl_iss/pl_pwr_ch_3 (R25_3.2)
PWR_ENA_2_PL2: norbi_lm_main (U1.22), pl_iss/pl_pwr_ch_4 (R25_4.2)
PWR_ENA_3_PL1.1A: norbi_lm_main (U1.12), pl_iss/pl_pwr_ch_1 (R26_1.2)
PWR_ENA_3_PL1.1B: norbi_lm_main (U1.15), pl_iss/pl_pwr_ch_2 (R26_2.2)
PWR_ENA_3_PL1.2: norbi_lm_main (U1.20), pl_iss/pl_pwr_ch_3 (R26_3.2)
PWR_ENA_3_PL2: norbi_lm_main (U1.49), pl_iss/pl_pwr_ch_4 (R26_4.2)
PWR_ENA_3V3: norbi_lm_main (U1.26), lm_pwr_ch (R26_5.2)
PWR_GD: norbi_lm_main (R12.2 U1.112), pl_iss/pl_pwr_ch_1 (R42_1.1), pl_iss/pl_pwr_ch_2 (R42_2.1), pl_iss/pl_pwr_ch_3 (R42_3.1), pl_iss/pl_pwr_ch_4 (R42_4.1), lm_pwr_ch (R42_5.1)
PWR_SCL: norbi_lm_main (R10.2 U1.100), pl_iss/pl_pwr_ch_1 (R34_1.1 U6_1.5), pl_iss/pl_pwr_ch_2 (R34_2.1 U6_2.5), pl_iss/pl_pwr_ch_3 (R34_3.1 R39_3.1 U6_3.5), pl_iss/pl_pwr_ch_4 (R34_4.1 U6_4.5), pl_dcr/mcu_pwr (R62_1.1 U12_1.5), pl_dcr/measure_pwr (R62_2.1 U12_2.5), lm_pwr_ch (R34_5.1 U6_5.5)
PWR_SDA: norbi_lm_main (R9.2 U1.99), pl_iss/pl_pwr_ch_1 (R35_1.1 U6_1.4), pl_iss/pl_pwr_ch_2 (R35_2.1 R39_2.1 U6_2.4), pl_iss/pl_pwr_ch_3 (R35_3.1 U6_3.4), pl_iss/pl_pwr_ch_4 (R35_4.1 U6_4.4), pl_dcr/mcu_pwr (R63_1.1 U12_1.4), pl_dcr/measure_pwr (R63_2.1 R66_2.1 U12_2.4), lm_pwr_ch (R35_5.1 U6_5.4)
RT_FL_PL1: norbi_lm_main (H3.19 H3.20), norbi_lm_interface (VT2.3)
RT_FL_PL1_MC: norbi_lm_main (U1.28), norbi_lm_interface (U11.12)
SYS_FAILURE: norbi_lm_main (U1.65), pl_iss/pl_interface_4 (U20_4.14)
SYS_FAILURE_PL: norbi_lm_pl_iss (H2.47), pl_iss/pl_interface_4 (U20_4.3)
TM_ANA: norbi_lm_main (U1.68), pl_iss/pl_interface_4 (U20_4.11)
TM_ANA_TOP_PL: norbi_lm_pl_iss (H2.50), pl_iss/pl_interface_4 (R75_4.2)
TRM_ALERT: norbi_lm_main (R15.2 U1.140), norbi_lm_pl_iss (H1.52), norbi_lm_trm (R45.1 R47.2)
TRM_SCL: norbi_lm_main (R13.2 U1.69), norbi_lm_pl_iss (H2.14), norbi_lm_trm (R44.1 U7.2)
TRM_SDA: norbi_lm_main (R14.2 U1.70), norbi_lm_pl_iss (H2.13), norbi_lm_trm (R43.1 U7.1)
UART_RX_PL1.1A: norbi_lm_main (U1.37), pl_iss/pl_interface_1 (R71_1.1 U18_1.3)
UART_RX_PL1.1B: norbi_lm_main (U1.35), pl_iss/pl_interface_2 (R71_2.1 U18_2.3)
UART_RX_PL1.2: norbi_lm_main (U1.102), pl_iss/pl_interface_3 (R71_3.1 U18_3.3)
UART_RX_PL2: norbi_lm_main (U1.78), pl_iss/pl_interface_4 (R71_4.1 U18_4.3)
UART_RX_PLDCR_LM: norbi_lm_main (U1.97), norbi_lm_pl_dcr (U2.5)
UART_TX_PL1.1A: norbi_lm_main (U1.36), pl_iss/pl_interface_1 (R70_1.2 U17_1.2)
UART_TX_PL1.1B: norbi_lm_main (U1.34), pl_iss/pl_interface_2 (R70_2.2 U17_2.2)
UART_TX_PL1.2: norbi_lm_main (U1.101), pl_iss/pl_interface_3 (R70_3.2 U17_3.2)
UART_TX_PL2: norbi_lm_main (U1.77), pl_iss/pl_interface_4 (R70_4.2 U17_4.2)
UART_TX_PLDCR_LM: norbi_lm_main (U1.96), norbi_lm_pl_dcr (U2.3)
USB_D_N: norbi_lm_main (U1.103), norbi_lm_usb (C62.2 R79.1)
USB_D_P: norbi_lm_main (U1.104), norbi_lm_usb (C61.2 R78.1)